# Altium project HASEL_Pair_Dual_Polarity.PrjPcb
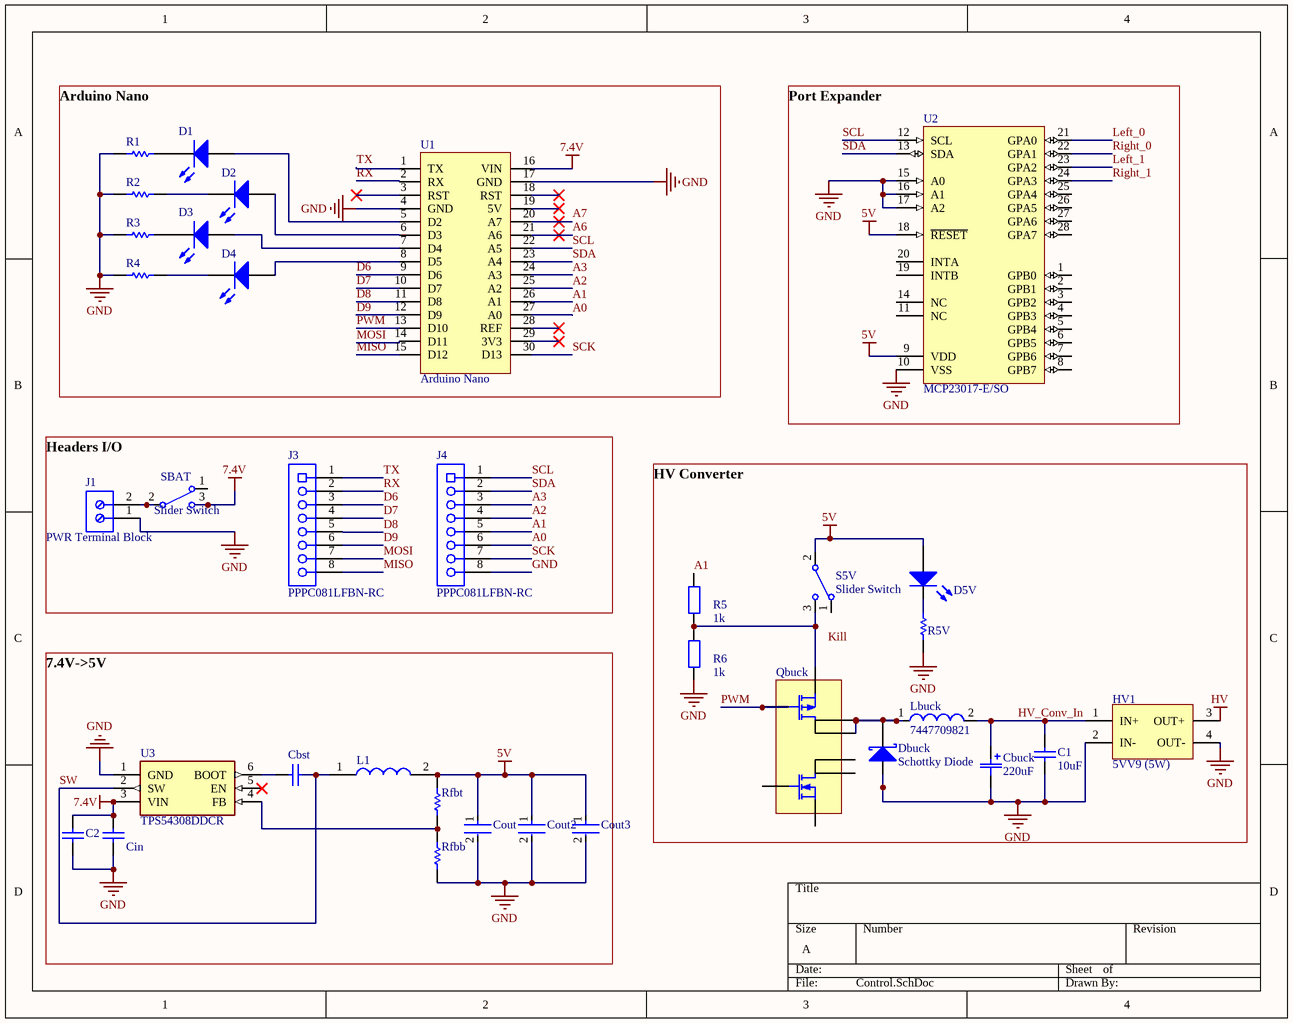
[diagram p0: Control.SchDoc]
2 sheets, 64 parts. Net scope: global (net labels, ports and power ports of the same name join across sheets).
Board file: HASEL_Pair_Dual_Polarity.PcbDoc
Sheets:
  Control.SchDoc
  Hbridge0.SchDoc

## Sheet Control.SchDoc
size A

### Parts
C1  value 10uF  [1206 CAP]  (hidden comment: Capacitor 10uF)
C2  C0805C104K5RACTU  [CAPC2013X88X50NL20T25]  (value not drawn)
Cbst  CAP 100nF 50V 0805(2012)  [CAPC0805(2012)100_M]  (value not drawn)
Cbuck  value 220uF  [SMD 7343 - Pol]  (hidden comment: Capacitor 220uF (Polarized))
Cin  GRM32ER61C226KE20L  [MURA-1210_H_2.7_L]  (value not drawn)
Cout  CL32B106KBJNNWE  [FP-CL32-IPC_B]  (value not drawn)
Cout2  CL32B106KBJNNWE  [FP-CL32-IPC_B]  (value not drawn)
Cout3  CL32B106KBJNNWE  [FP-CL32-IPC_B]  (value not drawn)
D1  150080SS75000  [0805_A]  (value not drawn)
D2  150080VS75000  [0805_A]  (value not drawn)
D3  150080SS75000  [0805_A]  (value not drawn)
D4  150080VS75000  [0805_A]  (value not drawn)
D5V  150080VS75000  [0805_A]  (value not drawn)
Dbuck  Schottky Diode  [Schottky Diode]
HV1  5VV9 (5W)  [5VV9]
J1  PWR Terminal Block  [691103110002]
J3  PPPC081LFBN-RC  [SLIN-PPPC081LFBN-RC_V]
J4  PPPC081LFBN-RC  [SLIN-PPPC081LFBN-RC_V]
L1  7443251600  [WE-HCI_105023]  (value not drawn)
Lbuck  7447709821  [WE-PD-XXL]
Qbuck  Dual MOSFET  [SO-8]  (value not drawn)
R1  ERJ-6GEYJ161V  [RESC0805(2012)_N]  (value not drawn)
R2  ERJ-6GEYJ161V  [RESC0805(2012)_N]  (value not drawn)
R3  ERJ-6GEYJ161V  [RESC0805(2012)_N]  (value not drawn)
R4  ERJ-6GEYJ161V  [RESC0805(2012)_N]  (value not drawn)
R5  value 1k  [1206 R]  (hidden comment: Resistor)
R5V  ERJ-6GEYJ161V  [RESC0805(2012)_N]  (value not drawn)
R6  value 1k  [1206 R]  (hidden comment: Resistor)
Rfbb  CRCW080513K7FKEA  [RESC2013X50X30ML20T20]  (value not drawn)
Rfbt  CRCW0805100KFKEA  [RESC2013X50X30NL20T20]  (value not drawn)
S5V  Slider Switch  [Slide Switch]
SBAT  Slider Switch  [Slide Switch]
U1  Arduino Nano  [Arduino Nano]
U2  MCP23017-E/SO  [SOIC-SO28_N]
U3  TPS54308DDCR  [SOT95P280X100-6N]

### Nets
5V: Cout.1 Cout2.1 Cout3.1 D5V.2(A) L1.2 Rfbt.2 S5V.2(NO) U2.9(VDD) U2.18(~{RESET})
7.4V: C2.2 Cin.2 SBAT.3 U1.16(VIN) U3.3(VIN)
GND: C1.1 C2.1 Cbuck.2 Cin.1 Cout.2 Cout2.2 Cout3.2 Dbuck.1(A) HV1.2(IN-) HV1.4(OUT-) J1.1 J4.8 R1.1 R2.1 R3.1 R4.1 R5V.1 R6.1 Rfbb.1 U1.4(GND) U1.17(GND) U2.10(VSS) U2.15(A0) U2.16(A1) U2.17(A2) U3.1(GND)
HV: HV1.3(OUT+)
A0: J4.6 U1.27(A0)
A1: J4.5 R5.2 U1.26(A1)
A2: J4.4 U1.25(A2)
A3: J4.3 U1.24(A3)
A6: U1.21(A6)
A7: U1.20(A7)
D6: J3.3 U1.9(D6)
D7: J3.4 U1.10(D7)
D8: J3.5 U1.11(D8)
D9: J3.6 U1.12(D9)
HV_Conv_In: C1.2 Cbuck.1 HV1.1(IN+) Lbuck.2
Left_0: U2.21(GPA0)
Left_1: U2.23(GPA2)
MISO: J3.8 U1.15(D12)
MOSI: J3.7 U1.14(D11)
PWM: Qbuck.4 U1.13(D10)
Right_0: U2.22(GPA1)
Right_1: U2.24(GPA3)
RX: J3.2 U1.2(RX)
SCK: J4.7 U1.30(D13)
SCL: J4.1 U1.22(A5) U2.12(SCL)
SDA: J4.2 U1.23(A4) U2.13(SDA)
SW: Cbst.2 L1.1 U3.2(SW)
TX: J3.1 U1.1(TX)
NetCbst_1: Cbst.1 U3.6(BOOT)
NetD1_1: D1.1(K) R1.2
NetD1_2: D1.2(A) U1.5(D2)
NetD2_1: D2.1(K) R2.2
NetD2_2: D2.2(A) U1.6(D3)
NetD3_1: D3.1(K) R3.2
NetD3_2: D3.2(A) U1.7(D4)
NetD4_1: D4.1(K) R4.2
NetD4_2: D4.2(A) U1.8(D5)
NetD5V_1: D5V.1(K) R5V.2
NetDbuck_2: Dbuck.2(K) Lbuck.1 Qbuck.5 Qbuck.6
NetJ1_2: J1.2 SBAT.2(NO)
NetQbuck_3: Qbuck.3 R5.1 R6.2 S5V.3
NetRfbb_2: Rfbb.2 Rfbt.1 U3.4(FB)

Not connected (* = marked no-connect by the designer): Qbuck 1 2 7 8; S5V 1(COMMON); SBAT 1(COMMON); U1 3(RST)* 18(RST)* 19(5V)* 28(REF)* 29(3V3)*; U2 1(GPB0) 2(GPB1) 3(GPB2) 4(GPB3) 5(GPB4) 6(GPB5) 7(GPB6) 8(GPB7) 11(NC) 14(NC) 19(INTB) 20(INTA) 25(GPA4) 26(GPA5) 27(GPA6) 28(GPA7); U3 5(EN)*

### Notes on the sheet
- Arduino Nano
- (near U2) Port Expander
- Headers I/O
- HV Converter
- 7.4V->5V
- Labels drawn without touching a wire or pin: Kill

### Library data of the parts
C1 = Capacitor 10uF: 1276-3038-6-ND / Manufacturer: CL31A106KAHNFNE
C2 = CMP-2007-00279-1: Manufacturer: Kemet; Part Number: C0805C104K5RACTU
Cbst = CMP-1036-04423-1: CAP 100nF 50V ±20% 0805 (2012 Metric) Thickness 1mm SMD; Case-Metric: 2012; Case-EIA: 0805; Tolerance: Â±20%; Technology: SMT; Rated Voltage: 50 V; Value: 100nF; Max Thickness: 1 mm
Cbuck = Capacitor 220uF (Polarized): Digikey: ‎399-8415-1-ND‎ / Manufacturer: ‎T491X227K016AT‎; Published: 8-Jun-2000; LatestRevisionDate: 17-Jul-2002; LatestRevisionNote: Re-released for DXP Platform.; PackageReference: RB7.6-15; Publisher: Altium Limited; PackageDescription: Polarized Capacitor (Radial); 2 Leads
Cin = CMP-2000-06361-1: Chip Monolithic Ceramic Capacitor, 22 uF, +/- 10%, -55 to 85 degC, 2-Pin SMD (1210), RoHS, Tape and Reel; Manufacturer: Murata; Product Training Modules: High-CapMultilayerCeramicCapacitors; Other Names: 490-1882-2; Online Catalog: GRMSeries; Voltage Rating DC: 16V; Temperature Coefficient: X5R; Capacitance: 22µF; Catalog Drawings: GRMSeries_1210_2.5; Featured Product: GA3SafetyRecognizedCapsandHi-CapMLCC; Applications: GeneralPurpose; Lead Spacing: -; Ratings: -; Standard Package: 1,000; Lead Style: -; Size / Dimension: 0.126"Lx0.098"W(3.20mmx2.50mm); Features: -; Thickness (Max): 0.106"(2.70mm); Package Description: 2-Pin Surface Mount Device, Body 3.2 x 2.5 mm; Series: GRM; Mounting Type: SurfaceMount,MLCC; Category: Capacitors; Package / Case: 1210(3225Metric); Datasheet Version: 05/2014; Datasheet URL: https://datasheet.ciiva.com/26915/getdatasheetpartid-88858-26915376.pdf; Mounting Technology: SurfaceMount; Package Reference: 1210; Tolerance: ±10%; Packaging: Tape&Reel(TR); Operating Temperature: -55°C~85°C; Voltage - Rated: 16V; Height - Seated (Max): -; Family: CeramicCapacitors; Manufacturer URL: http://www.murata.com/
Cout Cout2 Cout3 = CMP-13271-004028-1: Cap Ceramic 10uF 50V X7R ±10% SMD 1210 +125°C Embossed T/R; Dielectric: X7R; Packaging: Tape and Reel; Width: 0.098inch; Case Code (Metric): 3225; Length: 0.126inch; Mount: Surface Mount; Max Operating Temperature: 125°C; Thickness: 0.106inch; Min Operating Temperature: -55°C; Case/Package: 1210; Lead Free: Lead Free; Voltage Rating: 50V; Capacitance: 10uF; Case Code (Imperial): 1210; Package Quantity: 1; Tolerance: 10%
D1 D3 = CMP-1426-00010-1: SMD mono-color Chip LED, WL-SMCW, Super Red; Manufacturer: Wuerth Elektronik; PackageReference: 0805_A; ComponentLink2URL: http://katalog.we-online.com/led/datasheet/150080SS75000.pdf; ComponentLink1URL: http://www.we-online.com; Color: Super Red; ComponentLink2Description: Datasheet; ComponentLink1Description: Manufacturer URL; PartNumber: 150080SS75000
D2 D4 D5V = CMP-1426-00009-1: SMD mono-color Chip LED, WL-SMCW, Bright Green; Manufacturer: Wuerth Elektronik; ComponentLink1Description: Manufacturer URL; Color: Bright Green; PackageReference: 0805_A; PartNumber: 150080VS75000; ComponentLink1URL: http://www.we-online.com; ComponentLink2Description: Datasheet; ComponentLink2URL: http://katalog.we-online.com/led/datasheet/150080VS75000.pdf
HV1 = 5VV9
J1 = CMP-1502-03254-1: Series 1031 - 3.50 mm Horizontal Entry Modular with Pressure Clamp WR-TBL, 2 pin; Manufacturer: Wurth Elektronik; Pin Number: 2; Pitch: 3.50mm; Datasheet URL: http://katalog.we-online.de/em/datasheet/6911031100xx.pdf; Package Reference: 691103110002; Publisher: WurthElektronik; Manufacturer URL: http://www.we-online.de; Mounting Technology: THT; Operating Temperature: -40to105degC; Part Number: 691103110002; Packaging: Box
J3 J4 = CMP-1770-00002-1: Female Header, Pitch 2.54 mm, 1 x 8 Position, Height 8.5 mm, Tail Length 3.2 mm, -40 to 105 degC, RoHS, Bulk; Case\Package: TO-252-3; Rds On Max: 115 mohm; Typical Rise Time: 90 ns; Max Power Dissipation: 2.5 W; Input Capacitance: 350 pF; Elements: 1; Height: 2.39 mm; Min Operating Temperature: -55 degC; RoHSCompliant: true; PackageDescription: Female Header, Pitch 2.54 mm, 1 x 8 Position, Height 8.5 mm, Tail Length 3.2 mm; Length: 6.73 mm; ComponentLink1Description: Datasheet; Package Quantity: 2500; Max Operating Temperature: 150 degC; Width: 6.22 mm; Radiation Hardening: No; Packaging: Tape and Reel; REACH SVHC: No SVHC; Pins: 3; PackageReference: PPPC081LFBN-RC; ComponentLink1URL: http://sullinscorp.com/catalogs/101_PAGE114-115_.100_FEMALE_HDR.pdf; DatasheetVersion: Jan-15; Mount: Surface Mount
L1 = 7443251600: Inductor; Manufacturer_Name: Wurth Elektronik; Manufacturer_Part_Number: 7443251600; Mouser Part Number: 710-7443251600; Mouser Price/Stock: https://www.mouser.co.uk/ProductDetail/Wurth-Elektronik/7443251600?qs=VxkwJfKV0FSkbbPOgC7FsA%3D%3D
Lbuck = CMP-0227-00163-1: SMD-Shielded Power Inductor WE-PD, L = 820 µH; Inductance: 820 ÂµH; PackageDescription: SMD Inductor, 2-Leads, Body 12.0 x 12.0 mm; ComponentLink2URL: http://www.we-online.de/katalog/media/pdf/7447709821.pdf; ComponentLink1Description: Manufacturer Link; DatasheetVersion: ver 1, Jan-2007; ComponentLink2Description: Datasheet; ComponentLink1URL: http://www.we-online.com; PackageReference: WE-PD-XXL; PackageVersion: 2004
R1-R4 R5V = CMP-1013-00055-1: 160R 0.125W 5% 0805 (2012 Metric)  SMD; Case-EIA: 0805; Case-Metric: 2012; Value: 160.00 Ohm; Technology: SMT; Tolerance: 5 %; Power: 0.125 W
R5 R6 = Resistor 1k: ‎541-2245-1-ND‎ / Manufacturer: ‎RCA12061K00FKEA‎
Rfbb = CMP-2001-04947-1: Manufacturer: Vishay Dale; Part Number: CRCW080513K7FKEA
Rfbt = CMP-2001-04899-1: Manufacturer: Vishay Dale; Part Number: CRCW0805100KFKEA
S5V SBAT = Switch-SPST: Digikey: ‎563-1571-ND‎ / Manufacturer:‎ MHS122-1‎; Published: 24-Mar-1999; LatestRevisionDate: 17-Jul-2002; LatestRevisionNote: Re-released for DXP Platform.; PackageReference: SPST-2; Publisher: Altium Limited; PackageDescription: Switch; 2 Leads
U2 = CMP-0186-00161-2: 16-Bit I/O Expander with Serial Interface, 28-Pin SOIC, Extended Temperature; PackageReference: SOIC-SO28; ComponentLink2URL: http://ww1.microchip.com/downloads/en/DeviceDoc/21952b.pdf; PackageVersion: revBB, Aug-2009; ComponentLink1URL: http://www.microchip.com/; Code_JEDEC: MS-013; ComponentLink2Description: Datasheet; DatasheetVersion: revB, Feb-2007; PackageDescription: 28-Lead Plastic Small Outline (SO) - Wide 7.50mm Body [SOIC]; ComponentLink3Description: Package Specification; ComponentLink1Description: Manufacturer URL; RevisionNote: URLs added.; ComponentLink3URL: http://www.microchip.com/stellent/groups/techpub_sg/documents/packagingspec/en012702.pdf
U3 = TPS54308DDCR: Power Supply; Manufacturer_Name: Texas Instruments; Datasheet Link: http://www.ti.com/lit/gpn/tps54308; Height: 1mm; Manufacturer_Part_Number: TPS54308DDCR; Arrow Part Number: TPS54308DDCR; Arrow Price/Stock: https://www.arrow.com/en/products/tps54308ddcr/texas-instruments; Mouser Part Number: 595-TPS54308DDCR; Mouser Price/Stock: https://www.mouser.co.uk/ProductDetail/Texas-Instruments/TPS54308DDCR?qs=gt1LBUVyoHl9iRtozvTSQw%3D%3D

## Sheet Hbridge0.SchDoc
size A
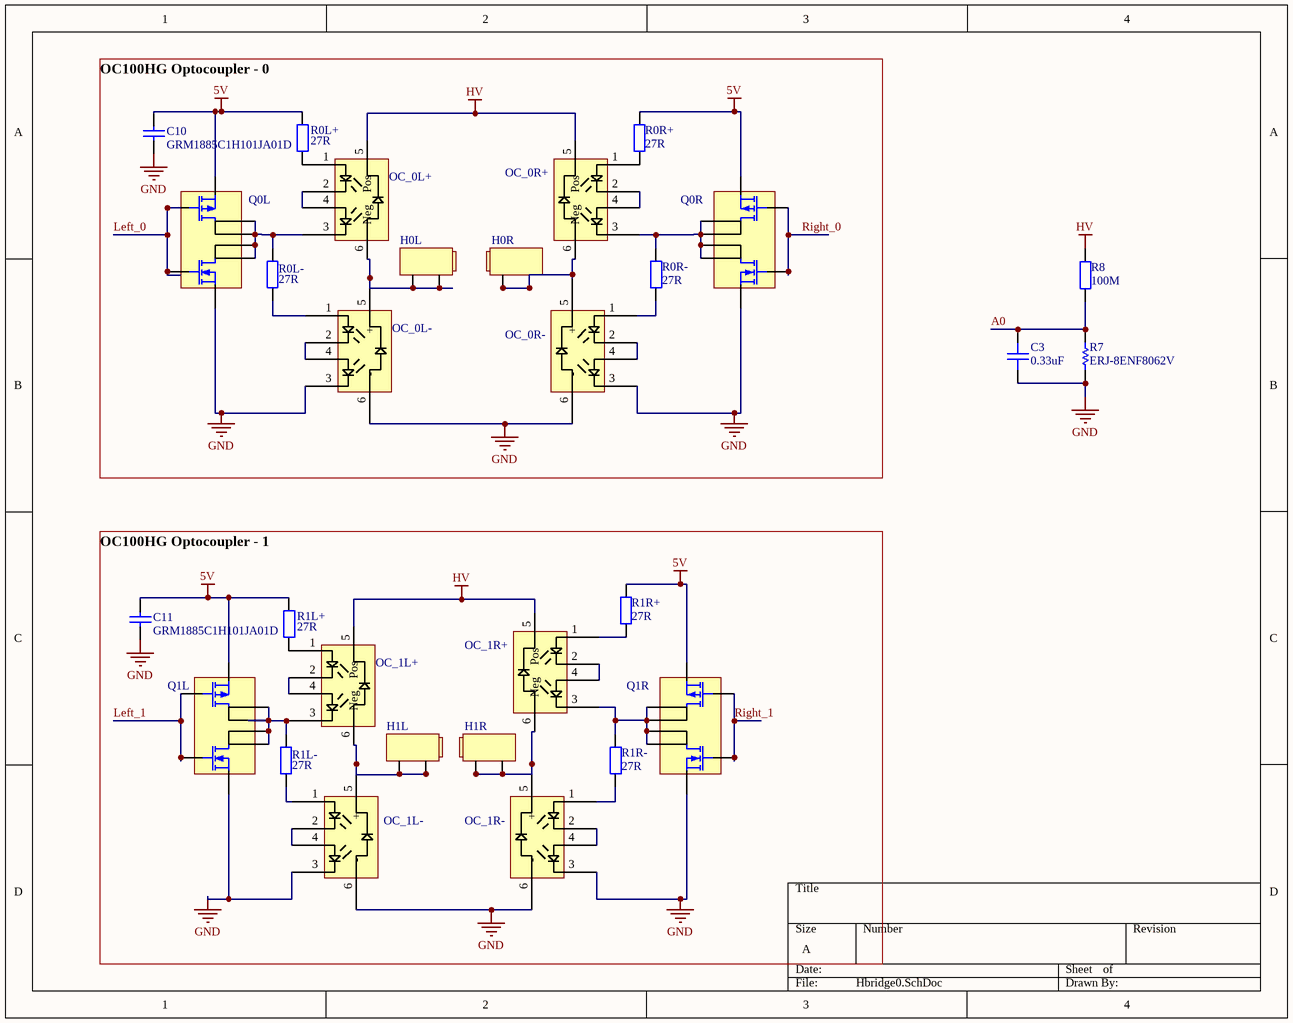
[diagram p1: Hbridge0.SchDoc]

### Parts
C3  value 0.33uF  [1206 CAP]  (hidden comment: Capacitor 0.33uF)
C10  GRM1885C1H101JA01D  [CAPC1608X90X35NL10T15]
C11  GRM1885C1H101JA01D  [CAPC1608X90X35NL10T15]
H0L  HV Socket  [HV Socket 2mm]  (value not drawn)
H0R  HV Socket  [HV Socket 2mm]  (value not drawn)
H1L  HV Socket  [HV Socket 2mm]  (value not drawn)
H1R  HV Socket  [HV Socket 2mm]  (value not drawn)
OC_0L+  OC100HG  [OC100G]  (value not drawn)
OC_0L-  OC100HG  [OC100G]  (value not drawn)
OC_0R+  OC100HG  [OC100G]  (value not drawn)
OC_0R-  OC100HG  [OC100G]  (value not drawn)
OC_1L+  OC100HG  [OC100G]  (value not drawn)
OC_1L-  OC100HG  [OC100G]  (value not drawn)
OC_1R+  OC100HG  [OC100G]  (value not drawn)
OC_1R-  OC100HG  [OC100G]  (value not drawn)
Q0L  Dual MOSFET  [SO-8]  (value not drawn)
Q0R  Dual MOSFET  [SO-8]  (value not drawn)
Q1L  Dual MOSFET  [SO-8]  (value not drawn)
Q1R  Dual MOSFET  [SO-8]  (value not drawn)
R0L+  value 27R  [1206 R]  (hidden comment: Resistor)
R0L-  value 27R  [1206 R]  (hidden comment: Resistor)
R0R+  value 27R  [1206 R]  (hidden comment: Resistor)
R0R-  value 27R  [1206 R]  (hidden comment: Resistor)
R1L+  value 27R  [1206 R]  (hidden comment: Resistor)
R1L-  value 27R  [1206 R]  (hidden comment: Resistor)
R1R+  value 27R  [1206 R]  (hidden comment: Resistor)
R1R-  value 27R  [1206 R]  (hidden comment: Resistor)
R7  ERJ-8ENF8062V  [RESC3216X70X50LL05T20]
R8  value 100M  [HV resistor]  (hidden comment: Resistor)

### Nets
5V: C10.2 C11.2 Q0L.3 Q0R.3 Q1L.3 Q1R.3 R0L+.2 R0R+.2 R1L+.2 R1R+.2
GND: C3.1 C10.1 C11.1 OC_0L-.3(LED_2-) OC_0L-.6(-) OC_0R-.3(LED_2-) OC_0R-.6(-) OC_1L-.3(LED_2-) OC_1L-.6(-) OC_1R-.3(LED_2-) OC_1R-.6(-) Q0L.1 Q0R.1 Q1L.1 Q1R.1 R7.1
HV: OC_0L+.5(Pos) OC_0R+.5(Pos) OC_1L+.5(Pos) OC_1R+.5(Pos) R8.2
A0: C3.2 R7.2 R8.1
Left_0: Q0L.2 Q0L.4
Left_1: Q1L.2 Q1L.4
Right_0: Q0R.2 Q0R.4
Right_1: Q1R.2 Q1R.4
NetH0L_1: H0L.1 H0L.2 OC_0L+.6(Neg) OC_0L-.5(+)
NetH0R_1: H0R.1 H0R.2 OC_0R+.6(Neg) OC_0R-.5(+)
NetH1L_1: H1L.1 H1L.2 OC_1L+.6(Neg) OC_1L-.5(+)
NetH1R_1: H1R.1 H1R.2 OC_1R+.6(Neg) OC_1R-.5(+)
NetOC_0L+_1: OC_0L+.1(LED_1+) R0L+.1
NetOC_0L+_2: OC_0L+.2(LED_1-) OC_0L+.4(LED_2+)
NetOC_0L+_3: OC_0L+.3(LED_2-) Q0L.5 Q0L.6 Q0L.7 Q0L.8 R0L-.1
NetOC_0L-_1: OC_0L-.1(LED_1+) R0L-.2
NetOC_0L-_2: OC_0L-.2(LED_1-) OC_0L-.4(LED_2+)
NetOC_0R+_1: OC_0R+.1(LED_1+) R0R+.1
NetOC_0R+_2: OC_0R+.2(LED_1-) OC_0R+.4(LED_2+)
NetOC_0R+_3: OC_0R+.3(LED_2-) Q0R.5 Q0R.6 Q0R.7 Q0R.8 R0R-.1
NetOC_0R-_1: OC_0R-.1(LED_1+) R0R-.2
NetOC_0R-_2: OC_0R-.2(LED_1-) OC_0R-.4(LED_2+)
NetOC_1L+_1: OC_1L+.1(LED_1+) R1L+.1
NetOC_1L+_2: OC_1L+.2(LED_1-) OC_1L+.4(LED_2+)
NetOC_1L+_3: OC_1L+.3(LED_2-) Q1L.5 Q1L.6 Q1L.7 Q1L.8 R1L-.1
NetOC_1L-_1: OC_1L-.1(LED_1+) R1L-.2
NetOC_1L-_2: OC_1L-.2(LED_1-) OC_1L-.4(LED_2+)
NetOC_1R+_1: OC_1R+.1(LED_1+) R1R+.1
NetOC_1R+_2: OC_1R+.2(LED_1-) OC_1R+.4(LED_2+)
NetOC_1R+_3: OC_1R+.3(LED_2-) Q1R.5 Q1R.6 Q1R.7 Q1R.8 R1R-.1
NetOC_1R-_1: OC_1R-.1(LED_1+) R1R-.2
NetOC_1R-_2: OC_1R-.2(LED_1-) OC_1R-.4(LED_2+)

### Notes on the sheet
- OC100HG Optocoupler - 0
- OC100HG Optocoupler - 1

### Library data of the parts
C3 = Capacitor 0.33uF: ‎399-1285-1-ND‎ Manufacturer: ‎C1206C334K3RACTU‎
C10 C11 = CMP-2006-02595-1: Manufacturer: Murata; Part Number: GRM1885C1H101JA01D
H0L H0R H1L H1R = HV Socket: Black: 486-3654-ND / Red: ‎486-3655-ND‎
R0L+ R0L- R0R+ R0R- R1L+ R1L- R1R+ R1R- = Resistor 27R: Manufacturer ‎HRG3216Q-27R0-D-T1‎ / Digikey ‎408-1908-1-ND
R7 = CMP-2003-00504-1: Manufacturer: Panasonic; Part Number: ERJ-8ENF8062V
R8 = Resistor 100M: Digikey:‎SM102031006FE-ND‎ / Manufacturer: ‎SM102031006FE-ND‎

## Nets that join several sheets
5V: Control (9 pins), Hbridge0 (10 pins)
GND: Control (26 pins), Hbridge0 (16 pins)
HV: Control (HV1.3), Hbridge0 (5 pins)
A0: Control (J4.6 U1.27), Hbridge0 (C3.2 R7.2 R8.1)
Left_0: Control (U2.21), Hbridge0 (Q0L.2 Q0L.4)
Left_1: Control (U2.23), Hbridge0 (Q1L.2 Q1L.4)
Right_0: Control (U2.22), Hbridge0 (Q0R.2 Q0R.4)
Right_1: Control (U2.24), Hbridge0 (Q1R.2 Q1R.4)